# EAGLE design legatus_1_1 (EAGLE 9.6.2)
CNAME: Parrot Teensy Board; CREVISION: 1.0; DESIGNER: Nathan Villicana-Shaw

## Sheet 1 of 2
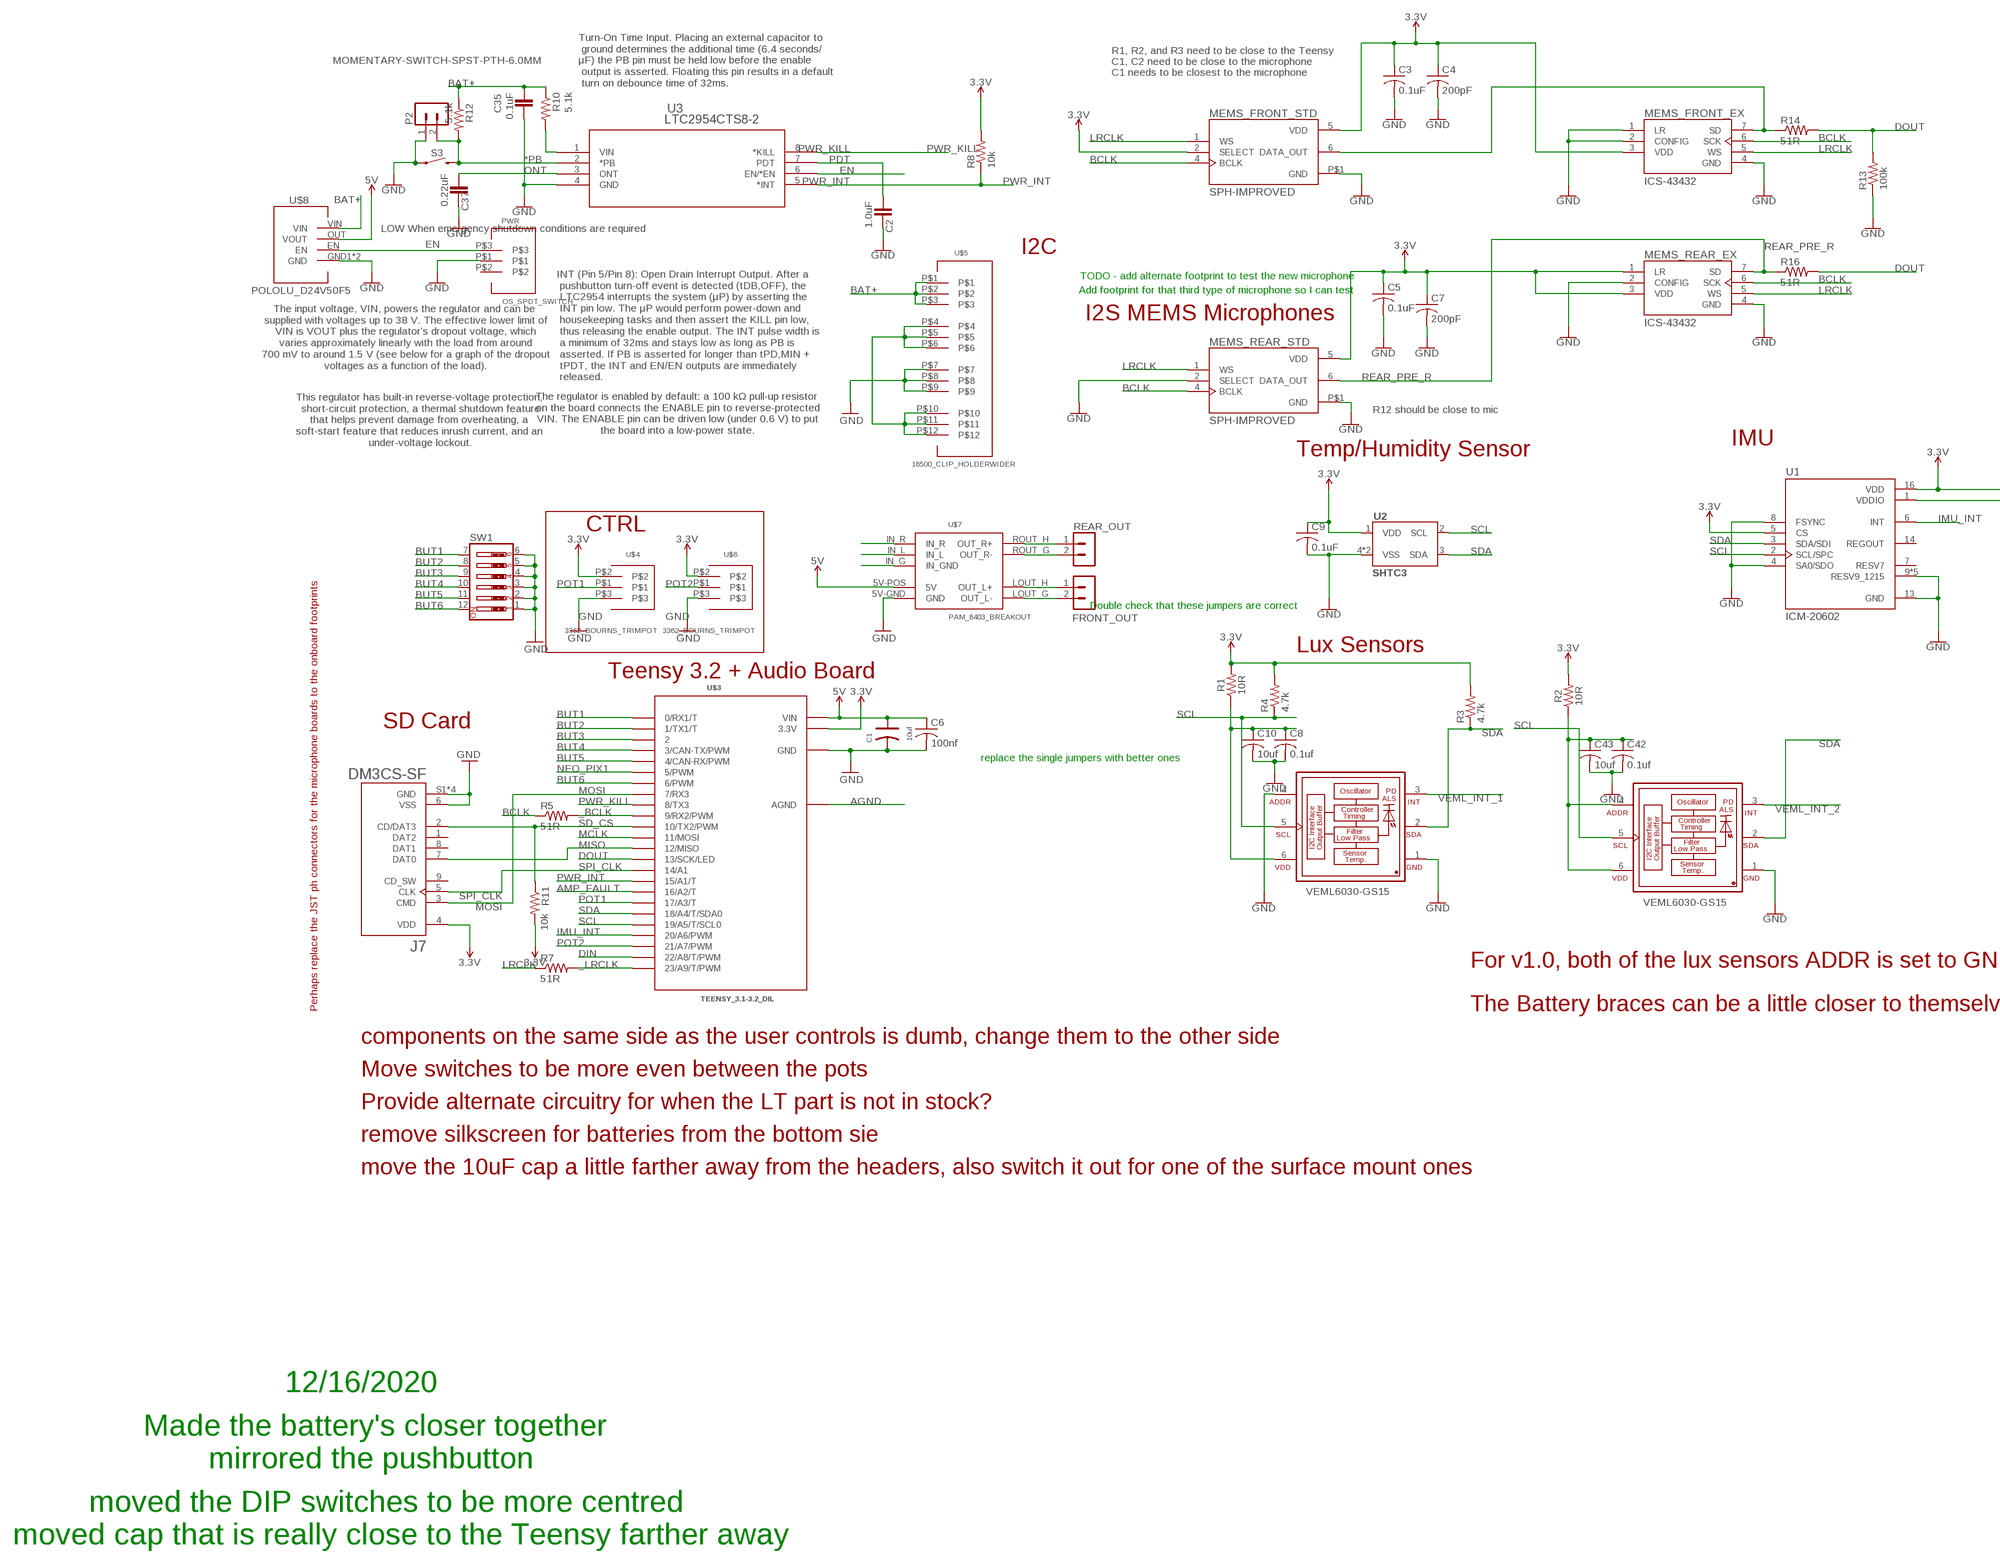
[diagram p0: schematic, sheet 1, part 1 of 2]
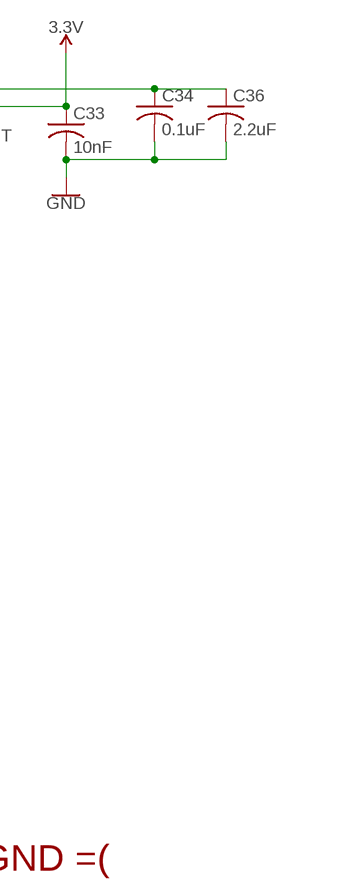
[diagram p1: schematic, sheet 1, part 2 of 2]

### Parts
C1  10uf  DIP-ALUMINUM-47UF-16V(D5-H7MM)  [PC-D5.3MM]
C2  1.0uF  C_CHIP-0805(2012-METRIC)  [CAPC2012X110]
C3  0.1uF  C-USC0805  [C0805]
C4  200pF  C-USC0805  [C0805]
C5  0.1uF  C-USC0805  [C0805]
C6  100nf  C-USC2012  [C2012]
C7  200pF  C-USC0805  [C0805]
C8  0.1uf  C-USC0805  [C0805]
C9  0.1uF  C-USC0805  [C0805]
C10  10uf  C-USC0805  [C0805]
C33  10nF  C-USC0805  [C0805]
C34  0.1uF  C-USC0805  [C0805]
C35  0.1uF  C_CHIP-0805(2012-METRIC)  [CAPC2012X110]
C36  2.2uF  C-USC0805  [C0805]
C37  0.22uF  C_CHIP-0805(2012-METRIC)  [CAPC2012X110]
C42  0.1uf  C-USC0805  [C0805]
C43  10uf  C-USC0805  [C0805]
FRONT_OUT  B2B-PH-K  [B2B-PH-K]
J7  DM3CS-SF  [HRS_DM3CS-SF]
MEMS_FRONT_EX  ICS-43432  [ICS-43432]
MEMS_FRONT_STD  SPH-IMPROVED  [MIC_SPH0645LM4H-B_LARGER_RING]
MEMS_REAR_EX  ICS-43432  [ICS-43432]
MEMS_REAR_STD  SPH-IMPROVED  [MIC_SPH0645LM4H-B_LARGER_RING]
P2  B2B-PH-K  [B2B-PH-K]
PWR  OS_SPDT_SWITCH  [OS_SPDT_SLIDE_SWITCH]
R1  10R  R-US_R0805  [R0805]
R2  10R  R-US_R0805  [R0805]
R3  4.7k  R-US_M0805  [M0805]
R4  4.7k  R-US_M0805  [M0805]
R5  51R  R-US_M0805  [M0805]
R7  51R  R-US_M0805  [M0805]
R8  10k  R-US_R0805  [R0805]
R10  5.1k  R-US_R0805  [R0805]
R11  10k  R-US_M0805  [M0805]
R12  5.1k  R-US_R0805  [R0805]
R13  100k  R-US_M0805  [M0805]
R14  51R  R-US_M0805  [M0805]
R16  51R  R-US_M0805  [M0805]
REAR_OUT  B2B-PH-K  [B2B-PH-K]
S3  MOMENTARY-SWITCH-SPST-PTH-6.0MM  [TACTILE_SWITCH_PTH_6.0MM]
SW1  SW_DIP-6  [EDG-06]
U1  ICM-20602  [PQFN50P300X300X80-16N]
U2  SHTC3  [SHTC3]
U3  LTC2954CTS8-2  [TSOT-23_TS8]
U$3  TEENSY_3.1-3.2_DIL  [TEENSY_3.0-3.2&LC_DIL]
U$4  3362_BOURNS_TRIMPOT  [3362_BOURNS_TRIMPOT]
U$5  18500_CLIP_HOLDERWIDER  [3PINBATTERY_CLIP_WIDER]
U$6  3362_BOURNS_TRIMPOT  [3362_BOURNS_TRIMPOT]
U$7  PAM_8403_BREAKOUT  [PAM8403_BREAKOUT]
U$8  POLOLU_D24V50F5  [POLOLU_D24V50F5]
VMEL_FRONT  VEML6030-GS15  [VISHAY_VEML6030_2X2X0.87]
VMEL_REAR  VEML6030-GS15  [VISHAY_VEML6030_2X2X0.87]

### Nets
3.3V [3.3V]: C3.1 C4.1 C5.1 C7.1 C9.1 C33.1 C34.1 C36.1 J7.4(VDD) MEMS_FRONT_EX.3(VDD) MEMS_FRONT_STD.2(SELECT) MEMS_FRONT_STD.5(VDD) MEMS_REAR_EX.1(LR) MEMS_REAR_EX.3(VDD) MEMS_REAR_STD.5(VDD) R1.2 R2.2 R3.2 R4.2 R8.2 R11.2 U1.1(VDDIO) U1.5(CS) U1.16(VDD) U2.1(VDD) U$3.3.3V U$4.P$2 U$6.P$2
5V: C1.+ C6.1 U$3.VIN U$7.5V-POS(5V) U$8.OUT(VOUT) ; also sheet 2
*PB: P2.2 R12.2 S3.3 U3.2(*PB)
_BCLK: R5.2 U$3.9(9/RX2/PWM)
_LRCLK: R7.2 U$3.23/A9(23/A9/T/PWM)
AGND [AGND]: U$3.AGND
AMP_FAULT: U$3.16/A2(16/A2/T)
BAT+: C35.1 R10.1 R12.1 U$5.P$1 U$5.P$2 U$5.P$3 U$8.VIN
BCLK: MEMS_FRONT_EX.6(SCK) MEMS_FRONT_STD.4(BCLK) MEMS_REAR_EX.6(SCK) MEMS_REAR_STD.4(BCLK) R5.1
BUT1: SW1.7 U$3.0(0/RX1/T)
BUT2: SW1.8 U$3.1(1/TX1/T)
BUT3: SW1.9 U$3.2
BUT4: SW1.10 U$3.3(3/CAN-TX/PWM)
BUT5: SW1.11 U$3.4(4/CAN-RX/PWM)
BUT6: SW1.12 U$3.6(6/PWM)
DIN: U$3.22/A8(22/A8/T/PWM)
DOUT: R13.2 R14.2 R16.2 U$3.13(13/SCK/LED)
EN: PWR.P$3 U3.6(EN/*EN) U$8.EN
FRONT_PRE_R: MEMS_FRONT_EX.7(SD) MEMS_FRONT_STD.6(DATA_OUT) R14.1
GND: C1.- C2.2 C3.2 C4.2 C5.2 C6.2 C7.2 C8.2 C9.2 C10.2 C33.2 C34.2 C35.2 C36.2 C37.2 C42.2 C43.2 J7.6(VSS) J7.S1(GND) J7.S2(GND) J7.S3(GND) J7.S5(GND) MEMS_FRONT_EX.1(LR) MEMS_FRONT_EX.2(CONFIG) MEMS_FRONT_EX.4(GND) MEMS_FRONT_STD.P$1(GND) MEMS_REAR_EX.2(CONFIG) MEMS_REAR_EX.4(GND) MEMS_REAR_STD.2(SELECT) MEMS_REAR_STD.P$1(GND) P2.1 PWR.P$1 R13.1 S3.1 SW1.1 SW1.2 SW1.3 SW1.4 SW1.5 SW1.6 U1.4(SA0/SDO) U1.8(FSYNC) U1.9(RESV9_1215) U1.10(RESV9_1215) U1.11(RESV9_1215) U1.12(RESV9_1215) U1.13(GND) U1.15(RESV9_1215) U2.4(VSS) U2.5(VSS) U3.4(GND) U$3.GND U$4.P$3 U$5.P$7 U$5.P$8 U$5.P$9 U$6.P$3 U$7.5V-GND(GND) U$8.GND1(GND) U$8.GND2(GND) VMEL_FRONT.1(GND) VMEL_FRONT.4(ADDR) VMEL_REAR.1(GND) ; also sheet 2
IMU_INT: U1.6(INT) U$3.20/A6(20/A6/PWM)
LRCLK: MEMS_FRONT_EX.5(WS) MEMS_FRONT_STD.1(WS) MEMS_REAR_EX.5(WS) MEMS_REAR_STD.1(WS) R7.1
MCLK: U$3.11(11/MOSI)
MISO: J7.7(DAT0) U$3.12(12/MISO)
MOSI: J7.3(CMD) U$3.7(7/RX3)
N$2: U$5.P$4 U$5.P$5 U$5.P$6 U$5.P$10 U$5.P$11 U$5.P$12
N$3: C42.1 C43.1 R2.1 VMEL_REAR.4(ADDR) VMEL_REAR.6(VDD)
N$4: C8.1 C10.1 R1.1 VMEL_FRONT.6(VDD)
N$5: R10.2 U3.1(VIN)
N$6: FRONT_OUT.2 U$7.LOUT_G(OUT_L-)
N$7: FRONT_OUT.1 U$7.LOUT_H(OUT_L+)
N$8: REAR_OUT.2 U$7.ROUT_G(OUT_R-)
N$22: REAR_OUT.1 U$7.ROUT_H(OUT_R+)
N$30: U$7.IN_G(IN_GND)
N$31: U$7.IN_L
N$32: U$7.IN_R
NEO_PIX1: U$3.5(5/PWM) ; also sheet 2
ONT: C37.1 U3.3(ONT)
PDT: C2.1 U3.7(PDT)
POT1: U$3.17/A3(17/A3/T) U$4.P$1
POT2: U$3.21/A7(21/A7/PWM) U$6.P$1
PWR_INT: R8.1 U3.5(*INT) U$3.15/A1(15/A1/T)
PWR_KILL: U3.8(*KILL) U$3.8(8/TX3)
REAR_PRE_R: MEMS_REAR_EX.7(SD) MEMS_REAR_STD.6(DATA_OUT) R16.1
SCL: R4.1 U1.2(SCL/SPC) U2.2(SCL) U$3.19/A5(19/A5/T/SCL0) VMEL_FRONT.5(SCL) VMEL_REAR.5(SCL)
SD_CS: J7.2(CD/DAT3) R11.1 U$3.10(10/TX2/PWM)
SDA: R3.1 U1.3(SDA/SDI) U2.3(SDA) U$3.18/A4(18/A4/T/SDA0) VMEL_FRONT.2(SDA) VMEL_REAR.2(SDA)
SPI_CLK: J7.5(CLK) U$3.14/A0(14/A1)
VEML_INT_1: VMEL_FRONT.3(INT)
VEML_INT_2: VMEL_REAR.3(INT)
Unconnected: J7.1(DAT2) J7.8(DAT1) J7.9(CD_SW) PWR.P$2 U1.7(RESV7) U1.14(REGOUT)

### Notes on the sheet
- R1, R2, and R3 need to be close to the Teensy
- C1, C2 need to be close to the microphone
- C1 needs to be closest to the microphone
- Turn-On Time Input. Placing an external capacitor to
   ground determines the additional time (6.4 seconds/
  μF) the PB pin must be held low before the enable
   output is asserted. Floating this pin results in a default
   turn on debounce time of 32ms.
- LOW When emergency shutdown conditions are required
- I2C
- TODO - add alternate footprint to test the new microphone
- Add footprint for that third type of microphone so I can test
- I2S MEMS Microphones
- The input voltage, VIN, powers the regulator and can be
   supplied with voltages up to 38 V. The effective lower limit of
   VIN is VOUT plus the regulator’s dropout voltage, which
   varies approximately linearly with the load from around
   700 mV to around 1.5 V (see below for a graph of the dropout
   voltages as a function of the load).
- INT (Pin 5/Pin 8): Open Drain Interrupt Output. After a
   pushbutton turn-off event is detected (tDB,OFF), the
   LTC2954 interrupts the system (μP) by asserting the
   INT pin low. The μP would perform power-down and
   housekeeping tasks and then assert the KILL pin low,
   thus releasing the enable output. The INT pulse width is
   a minimum of 32ms and stays low as long as PB is
   asserted. If PB is asserted for longer than tPD,MIN +
   tPDT, the INT and EN/EN outputs are immediately
   released.
- The regulator is enabled by default: a 100 kΩ pull-up resistor
   on the board connects the ENABLE pin to reverse-protected
   VIN. The ENABLE pin can be driven low (under 0.6 V) to put
   the board into a low-power state.
- R12 should be close to mic
- This regulator has built-in reverse-voltage protection, 
  short-circuit protection, a thermal shutdown feature
  that helps prevent damage from overheating, a 
  soft-start feature that reduces inrush current, and an 
  under-voltage lockout.
- IMU
- Temp/Humidity Sensor
- CTRL
- Double check that these jumpers are correct
- Lux Sensors
- Teensy 3.2 + Audio Board
- 10R
- 10R
- SD Card
- replace the single jumpers with better ones
- For v1.0, both of the lux sensors ADDR is set to GND =(
- Perhaps replace the JST ph connectors for the microphone boards to the onboard footprints | The Battery braces can be a little closer to themselves (the ends of the clips do not make a super strong connection with the cells
- components on the same side as the user controls is dumb, change them to the other side
- Move switches to be more even between the pots
- Provide alternate circuitry for when the LT part is not in stock?
- remove silkscreen for batteries from the bottom sie
- move the 10uF cap a little farther away from the headers, also switch it out for one of the surface mount ones
- 12/16/2020
- Made the battery's closer together
- mirrored the pushbutton
- moved the DIP switches to be more centred
- moved cap that is really close to the Teensy farther away

## Sheet 2 of 2: Neopixel LEDs
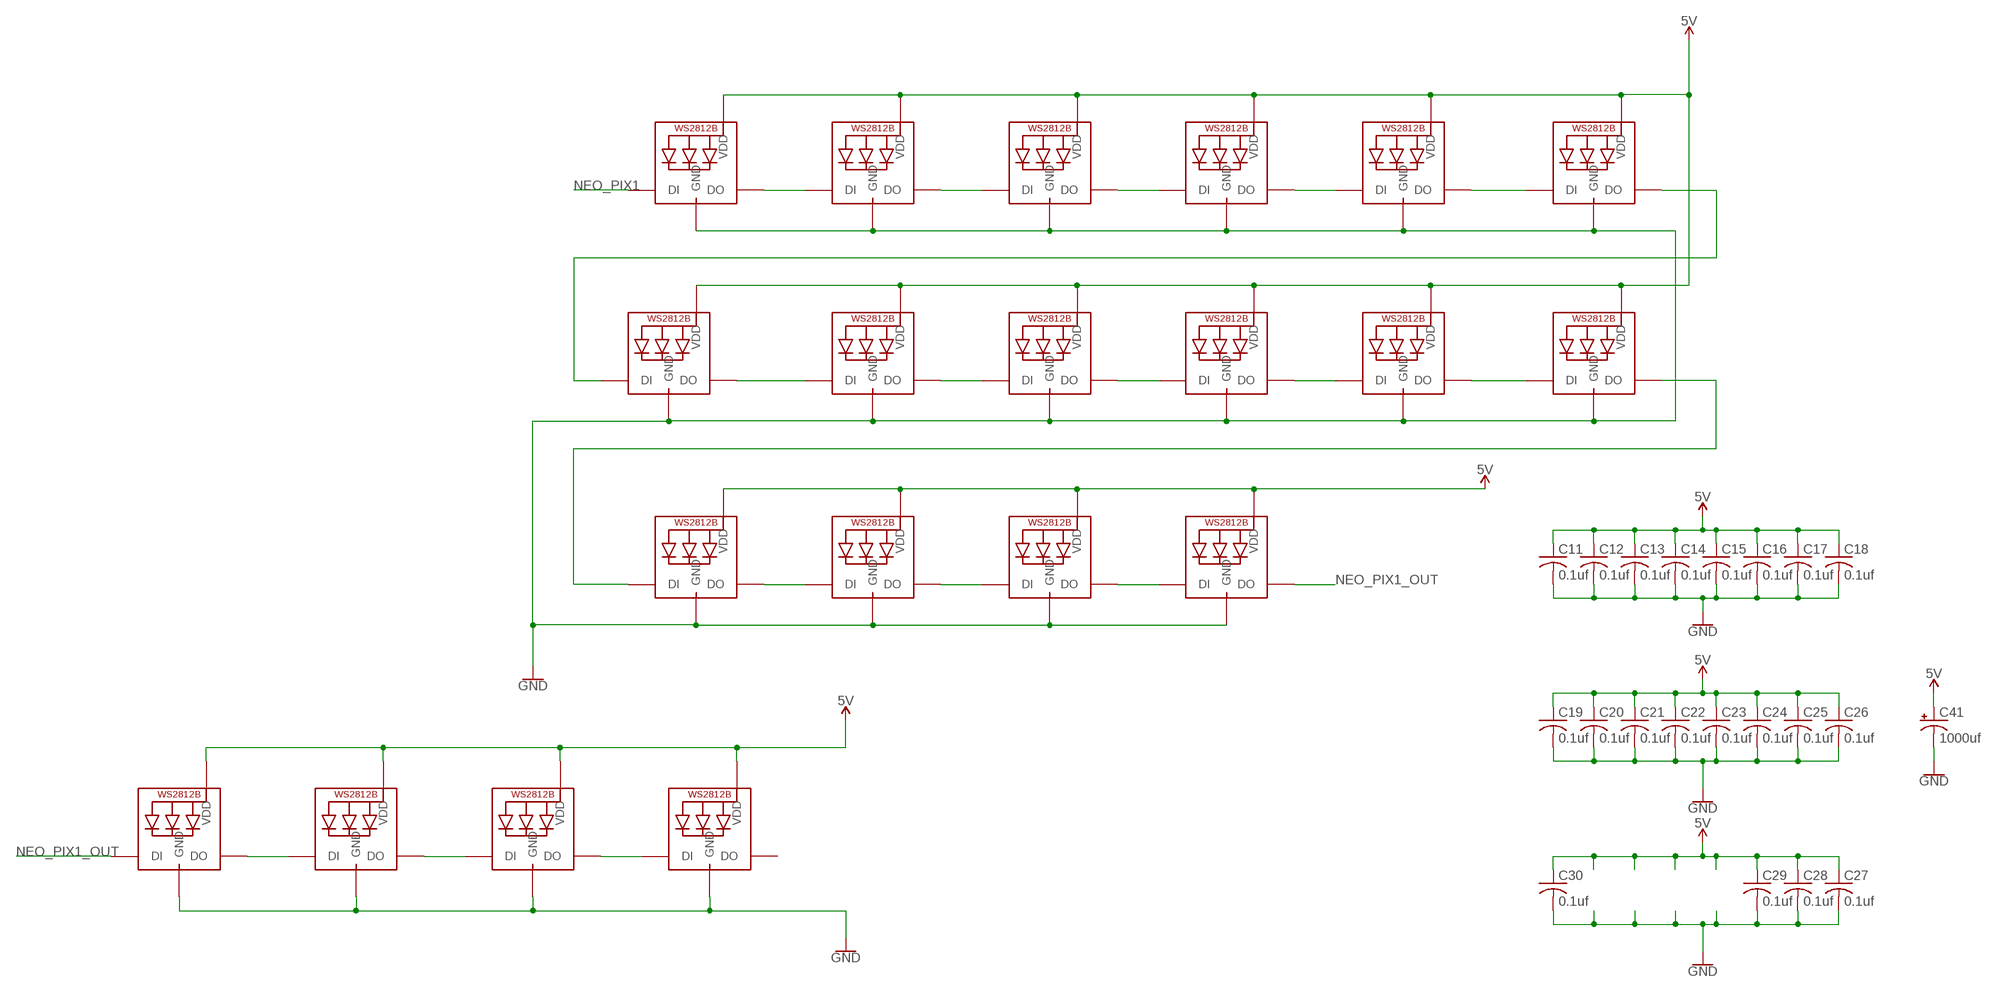
[diagram p2: schematic, sheet 2]

### Parts
C11  0.1uf  C-USC0805  [C0805]
C12  0.1uf  C-USC0805  [C0805]
C13  0.1uf  C-USC0805  [C0805]
C14  0.1uf  C-USC0805  [C0805]
C15  0.1uf  C-USC0805  [C0805]
C16  0.1uf  C-USC0805  [C0805]
C17  0.1uf  C-USC0805  [C0805]
C18  0.1uf  C-USC0805  [C0805]
C19  0.1uf  C-USC0805  [C0805]
C20  0.1uf  C-USC0805  [C0805]
C21  0.1uf  C-USC0805  [C0805]
C22  0.1uf  C-USC0805  [C0805]
C23  0.1uf  C-USC0805  [C0805]
C24  0.1uf  C-USC0805  [C0805]
C25  0.1uf  C-USC0805  [C0805]
C26  0.1uf  C-USC0805  [C0805]
C27  0.1uf  C-USC0805  [C0805]
C28  0.1uf  C-USC0805  [C0805]
C29  0.1uf  C-USC0805  [C0805]
C30  0.1uf  C-USC0805  [C0805]
C41  1000uf  CPOL-US153CLV-1010  [153CLV-1010]
LED1  WS2812B_5050N  [WS2812B-NARROW]
LED2  WS2812B_5050N  [WS2812B-NARROW]
LED3  WS2812B_5050N  [WS2812B-NARROW]
LED4  WS2812B_5050N  [WS2812B-NARROW]
LED5  WS2812B_5050N  [WS2812B-NARROW]
LED6  WS2812B_5050N  [WS2812B-NARROW]
LED7  WS2812B_5050N  [WS2812B-NARROW]
LED8  WS2812B_5050N  [WS2812B-NARROW]
LED9  WS2812B_5050N  [WS2812B-NARROW]
LED10  WS2812B_5050N  [WS2812B-NARROW]
LED11  WS2812B_5050N  [WS2812B-NARROW]
LED12  WS2812B_5050N  [WS2812B-NARROW]
LED13  WS2812B_5050N  [WS2812B-NARROW]
LED14  WS2812B_5050N  [WS2812B-NARROW]
LED15  WS2812B_5050N  [WS2812B-NARROW]
LED16  WS2812B_5050N  [WS2812B-NARROW]
LED17  WS2812B_5050N  [WS2812B-NARROW]
LED18  WS2812B_5050N  [WS2812B-NARROW]
LED19  WS2812B_5050N  [WS2812B-NARROW]
LED20  WS2812B_5050N  [WS2812B-NARROW]

### Nets
5V: C11.1 C12.1 C13.1 C14.1 C15.1 C16.1 C17.1 C18.1 C19.1 C20.1 C21.1 C22.1 C23.1 C24.1 C25.1 C26.1 C27.1 C28.1 C29.1 C30.1 C41.+ LED1.1-VDD(VDD) LED2.1-VDD(VDD) LED3.1-VDD(VDD) LED4.1-VDD(VDD) LED5.1-VDD(VDD) LED6.1-VDD(VDD) LED7.1-VDD(VDD) LED8.1-VDD(VDD) LED9.1-VDD(VDD) LED10.1-VDD(VDD) LED11.1-VDD(VDD) LED12.1-VDD(VDD) LED13.1-VDD(VDD) LED14.1-VDD(VDD) LED15.1-VDD(VDD) LED16.1-VDD(VDD) LED17.1-VDD(VDD) LED18.1-VDD(VDD) LED19.1-VDD(VDD) LED20.1-VDD(VDD) ; also sheet 1
GND: C11.2 C12.2 C13.2 C14.2 C15.2 C16.2 C17.2 C18.2 C19.2 C20.2 C21.2 C22.2 C23.2 C24.2 C25.2 C26.2 C27.2 C28.2 C29.2 C30.2 C41.- LED1.3-GND(GND) LED2.3-GND(GND) LED3.3-GND(GND) LED4.3-GND(GND) LED5.3-GND(GND) LED6.3-GND(GND) LED7.3-GND(GND) LED8.3-GND(GND) LED9.3-GND(GND) LED10.3-GND(GND) LED11.3-GND(GND) LED12.3-GND(GND) LED13.3-GND(GND) LED14.3-GND(GND) LED15.3-GND(GND) LED16.3-GND(GND) LED17.3-GND(GND) LED18.3-GND(GND) LED19.3-GND(GND) LED20.3-GND(GND) ; also sheet 1
N$9: LED1.2-DOUT(DO) LED2.4-DIN(DI)
N$10: LED2.2-DOUT(DO) LED3.4-DIN(DI)
N$11: LED3.2-DOUT(DO) LED4.4-DIN(DI)
N$12: LED4.2-DOUT(DO) LED5.4-DIN(DI)
N$13: LED5.2-DOUT(DO) LED6.4-DIN(DI)
N$14: LED7.2-DOUT(DO) LED8.4-DIN(DI)
N$15: LED8.2-DOUT(DO) LED9.4-DIN(DI)
N$16: LED9.2-DOUT(DO) LED10.4-DIN(DI)
N$17: LED10.2-DOUT(DO) LED11.4-DIN(DI)
N$18: LED11.2-DOUT(DO) LED12.4-DIN(DI)
N$19: LED13.2-DOUT(DO) LED14.4-DIN(DI)
N$20: LED14.2-DOUT(DO) LED15.4-DIN(DI)
N$21: LED15.2-DOUT(DO) LED16.4-DIN(DI)
N$23: LED12.2-DOUT(DO) LED13.4-DIN(DI)
N$24: LED6.2-DOUT(DO) LED7.4-DIN(DI)
N$26: LED18.2-DOUT(DO) LED19.4-DIN(DI)
N$29: LED19.2-DOUT(DO) LED20.4-DIN(DI)
N$43: LED17.2-DOUT(DO) LED18.4-DIN(DI)
NEO_PIX1: LED1.4-DIN(DI) ; also sheet 1
NEO_PIX1_OUT: LED16.2-DOUT(DO) LED17.4-DIN(DI)
Unconnected: LED20.2-DOUT(DO)

## Library data of the parts
C1 = Seeed-Capacitor:DIP-ALUMINUM-47UF-16V(D5-H7MM): 302030033; MPN: KS 100uF/16V; VALUE: 100uf
C2 C35 C37 = Capacitor:C: Capacitor - Generic; CATEGORY: Capacitor
C3-C5 C7-C30 C33 C34 C36 C42 C43 = rcl:C-US: CAPACITOR, American symbol; SPICEPREFIX: C
C6 = adafruit:C-US: CAPACITOR, American symbol
C41 = adafruit:CPOL-US: POLARIZED CAPACITOR, American symbol
FRONT_OUT P2 REAR_OUT = con-jst-ph:B2B-PH-K: HEADER
J7 = DM3CS-SF:DM3CS-SF: CONN MICRO SD CARD HINGED TYPE; AVAILABILITY: Unavailable; DESCRIPTION: 10 (8 + 2) Position Card Connector Secure Digital - microSD™ Surface Mount, Right Angle Gold; MF: Hirose; MP: DM3CS-SF; PACKAGE: None; PRICE: None
LED1-LED20 = nathans-custom-parts:WS2812B
MEMS_FRONT_EX MEMS_REAR_EX = Microphone:ICS-43432: MIC MEMS DIGITAL I2S OMNI -26DB Manufacturer's datasheet <http://www.invensense.com/wp-content/uploads/2015/02/ICS-43432_DS.pdf>; CREATED_BY: PCBLayout.com; DIGIKEY_PARTNO: 1428-1053-2-ND; MANUFACTURER: TDK InvenSense; MPN: ICS-43432
MEMS_FRONT_STD MEMS_REAR_STD = SPH0645LM4H-B:SPH-IMPROVED
PWR = nathans-custom-parts:OS_SPDT_SWITCH
R1 R2 = audio amplifier example:R-US_: RESISTOR, American symbol
R3-R5 R7 R13 R14 R16 = adafruit:R-US_: RESISTOR, American symbol
R8 R10 R12 = adafruit-with-additions:R-US_: RESISTOR, American symbol
R11 = rcl:R-US_: RESISTOR, American symbol; SPICEPREFIX: R
S3 = SparkFun-Switches:MOMENTARY-SWITCH-SPST: Momentary Switch (Pushbutton) - SPST Normally-open (NO) SPST momentary switches (buttons, pushbuttons). Variants PTH-12MM - 12mm square, through-hole Momentary Pushbutton Switch - 12mm Square <https://www.sparkfun.com/products/9190> (COM-09190) PTH-6.0MM, PTH-6.0MM-KIT - 6.0mm square, through-hole Mini Pushbutton Switch <https://www.sparkfun.com/products/97> (COM-00097) KIT package intended for soldering kit's - only one side of pads' copper is exposed. PTH-RIGHT-ANGLE-KIT - Right-angle, through-hole Right Angle Tactile Button <https://www.sparkfun.com/products/10791> - Used on SparkFun BigTime Watch Kit <https://www.sparkfun.com/products/11734> SMD-12MM - 12mm square, surface-mount Tactile Button - SMD (12mm) <https://www.sparkfun.com/products/12993> (COM-12993) Used on SparkFun PicoBoard <https://www.sparkfun.com/products/11888> SMD-4.5MM - 4.5mm Square Trackball Switch Used on SparkFun Blackberry Trackballer Breakout <https://www.sparkfun.com/products/13169> SMD-4.6MMX2.8MM - 4.60mm x 2.80mm, surface mount Used on SparkFun SAMD21 Mini Breakout <https://www.sparkfun.com/products/13664> SMD-5.2MM, SMD-5.2-REDUNDANT - 5.2mm square, surface-mount Mini Pushbutton Switch - SMD <https://www.sparkfun.com/products/8720> (COM-08720) Used on Arduino Pro Mini <https://www.sparkfun.com/products/11114> REDUNDANT package connects both switch circuits together SMD-6.0X3.5MM - 6.0 x 3.5mm, surface mount Momentary Reset Switch SMD <https://www.sparkfun.com/products/8229> (COM-08229) SMD-6.2MM-TALL - 6.2mm square, surface mount Tactile Button - SMD (6mm) <https://www.sparkfun.com/products/12992> Used on SparkFun Digital Sandbox <https://www.sparkfun.com/products/12651> SMD-RIGHT-ANGLE - Right-angle, surface mount Used on SparkFun Block for Intel® Edison - Arduino <https://www.sparkfun.com/products/13036>; PROD_ID: SWCH-08441; SF_SKU: COM-00097
SW1 = special:SW_DIP-6: DIP SWITCH
U1 = ICM-20602:ICM-20602: Accelerometer and Gyroscope Digital 16-Pin LGA Check prices <https://pricing.snapeda.com/parts/IAM-20680/TDK%20InvenSense/view-part?ref=eda> Check prices <https://pricing.snapeda.com/parts/ICM-20602/TDK%20InvenSense/view-part?ref=eda>; AVAILABILITY: Good; DESCRIPTION: Accelerometer, Gyroscope, Temperature, 6 Axis Sensor I²C, SPI Output; MF: TDK InvenSense; MP: ICM-20602; PACKAGE: PQFN-16 TDK-InvenSense; PRICE: None; PURCHASE-URL: https://pricing.snapeda.com/search/part/ICM-20602/?ref=eda
U2 = SHTC3:SHTC3
U3 = LTC2954CTS8-2:LTC2954CTS8-2: Check prices <https://pricing.snapeda.com/parts/LTC2954CTS8-2/Analog%20Devices%20/%20Linear%20Technology/view-part?ref=eda>; AVAILABILITY: Bad; DESCRIPTION: Power Supply Controller Push Button, On/Off Controller TSOT-23-8; MF: Analog Devices / Linear Technology; MP: LTC2954CTS8-2; PACKAGE: None; PRICE: None
U$3 = teensy_3_and_LC:TEENSY_3.1-3.2_DIL: Teensy 3.1 or 3.2 in a DIL Layout.
U$4 U$6 = nathans-custom-parts:3362_BOURNS_TRIMPOT
U$5 = nathans-custom-parts:18500_CLIP_HOLDER
U$7 = nathans-custom-parts:PAM_8403_BREAKOUT
U$8 = nathans-custom-parts:POLOLU_D24V50F5
VMEL_FRONT VMEL_REAR = VEML6030-GS15:VEML6030-GS15: VEML6030 High Accuracy Ambient Light Sensor with I2C Interface: VEML6030 is a high accuracy ambient light digital 16-bit resolution sensor in a miniature transparent 2 mm x 2 mm package. It includes a high sensitive photodiode, a low noise amplifier, a 16-bit A/D converter and supports an easy to use I2C bus communication interface and additional interrupt feature. The ambient light result is as digital value available. Device Model created 15.06.2016 by Johannes Kolb - Vishay Semiconductor GmbH; AVAILABILITY: Unavailable; DESCRIPTION: Optical Sensor Ambient 550nm I²C 6-SMD, No Lead; MF: Vishay Semiconductor; MP: VEML6030-GS15; PACKAGE: SMD-6 Vishay; PRICE: None

## Net classes
0 default: width 0.203 mm, drill 0.254 mm, clearance 0.203 mm
1 12V_IN: width 1.016 mm, drill 0.762 mm, clearance 0.305 mm
2 3.3V: width 0.305 mm, drill 0.508 mm, clearance 0.254 mm
3 5V: width 0.787 mm, drill 0.508 mm, clearance 0.381 mm
4 AGND: width 0.406 mm, drill 0.203 mm, clearance 0.203 mm

## Board
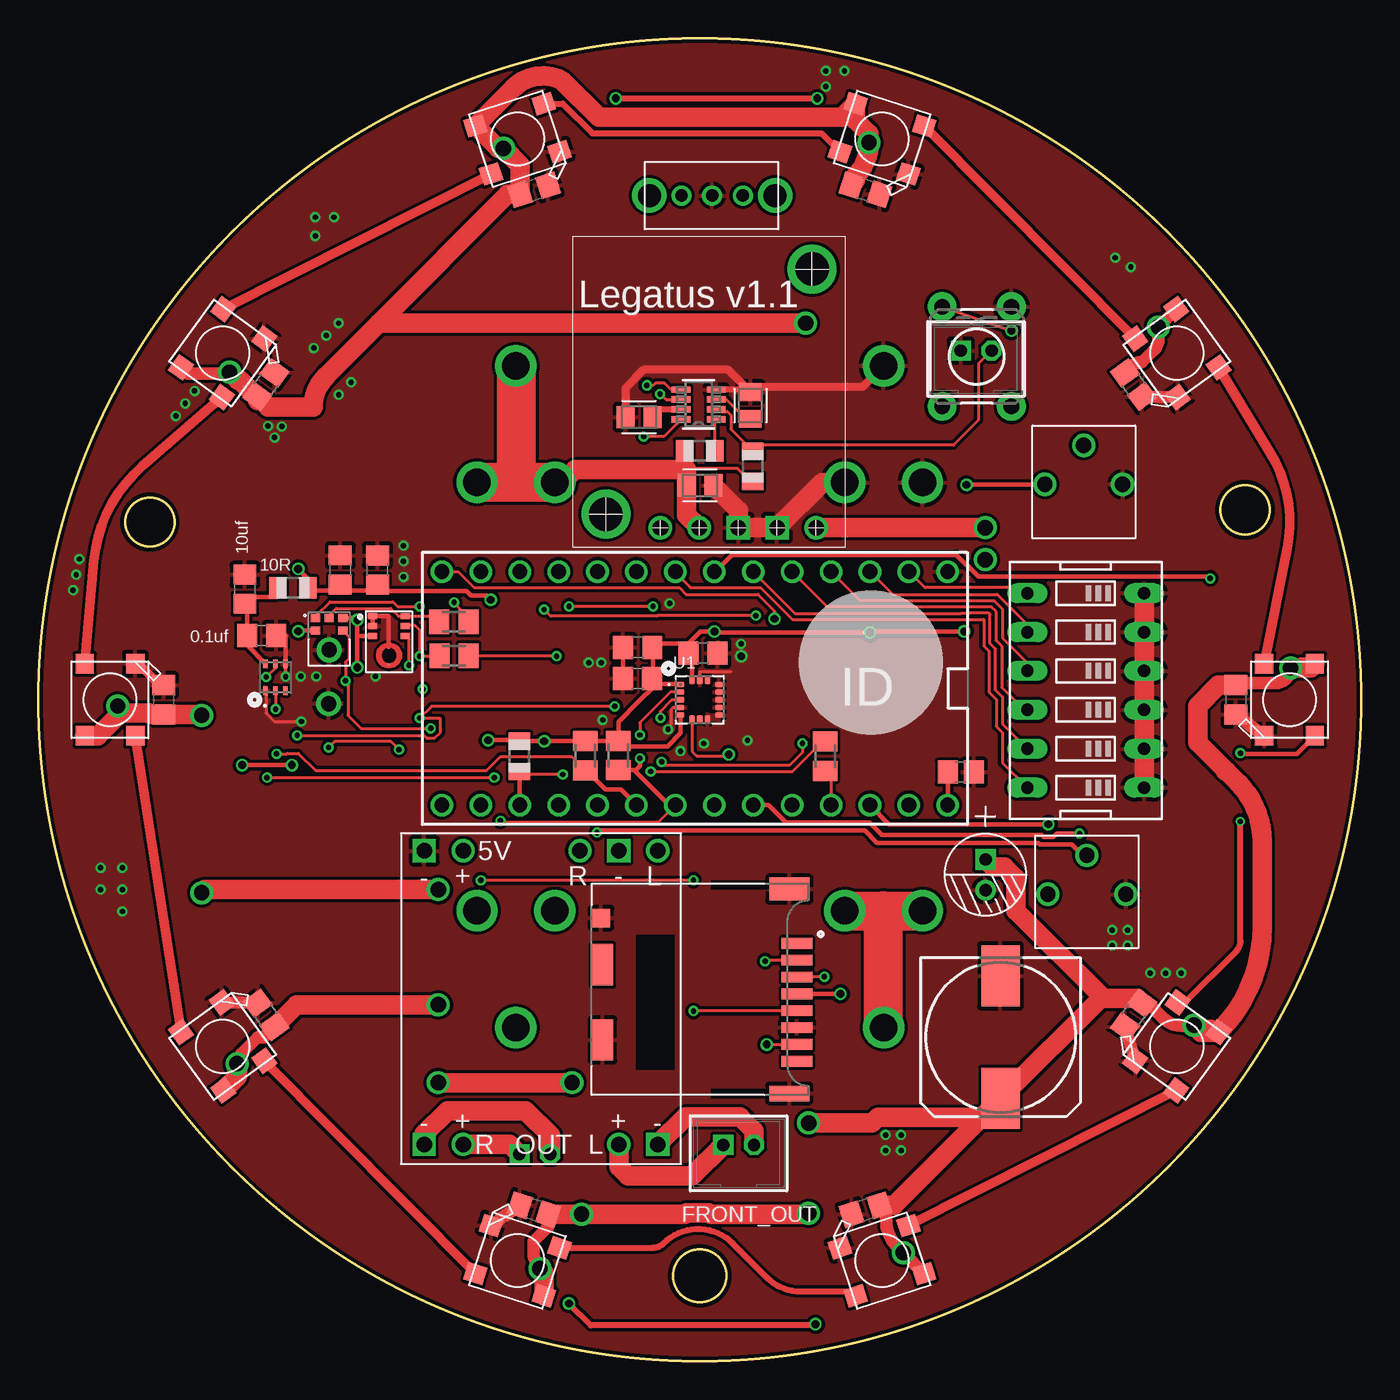
[diagram p3: board, top side]
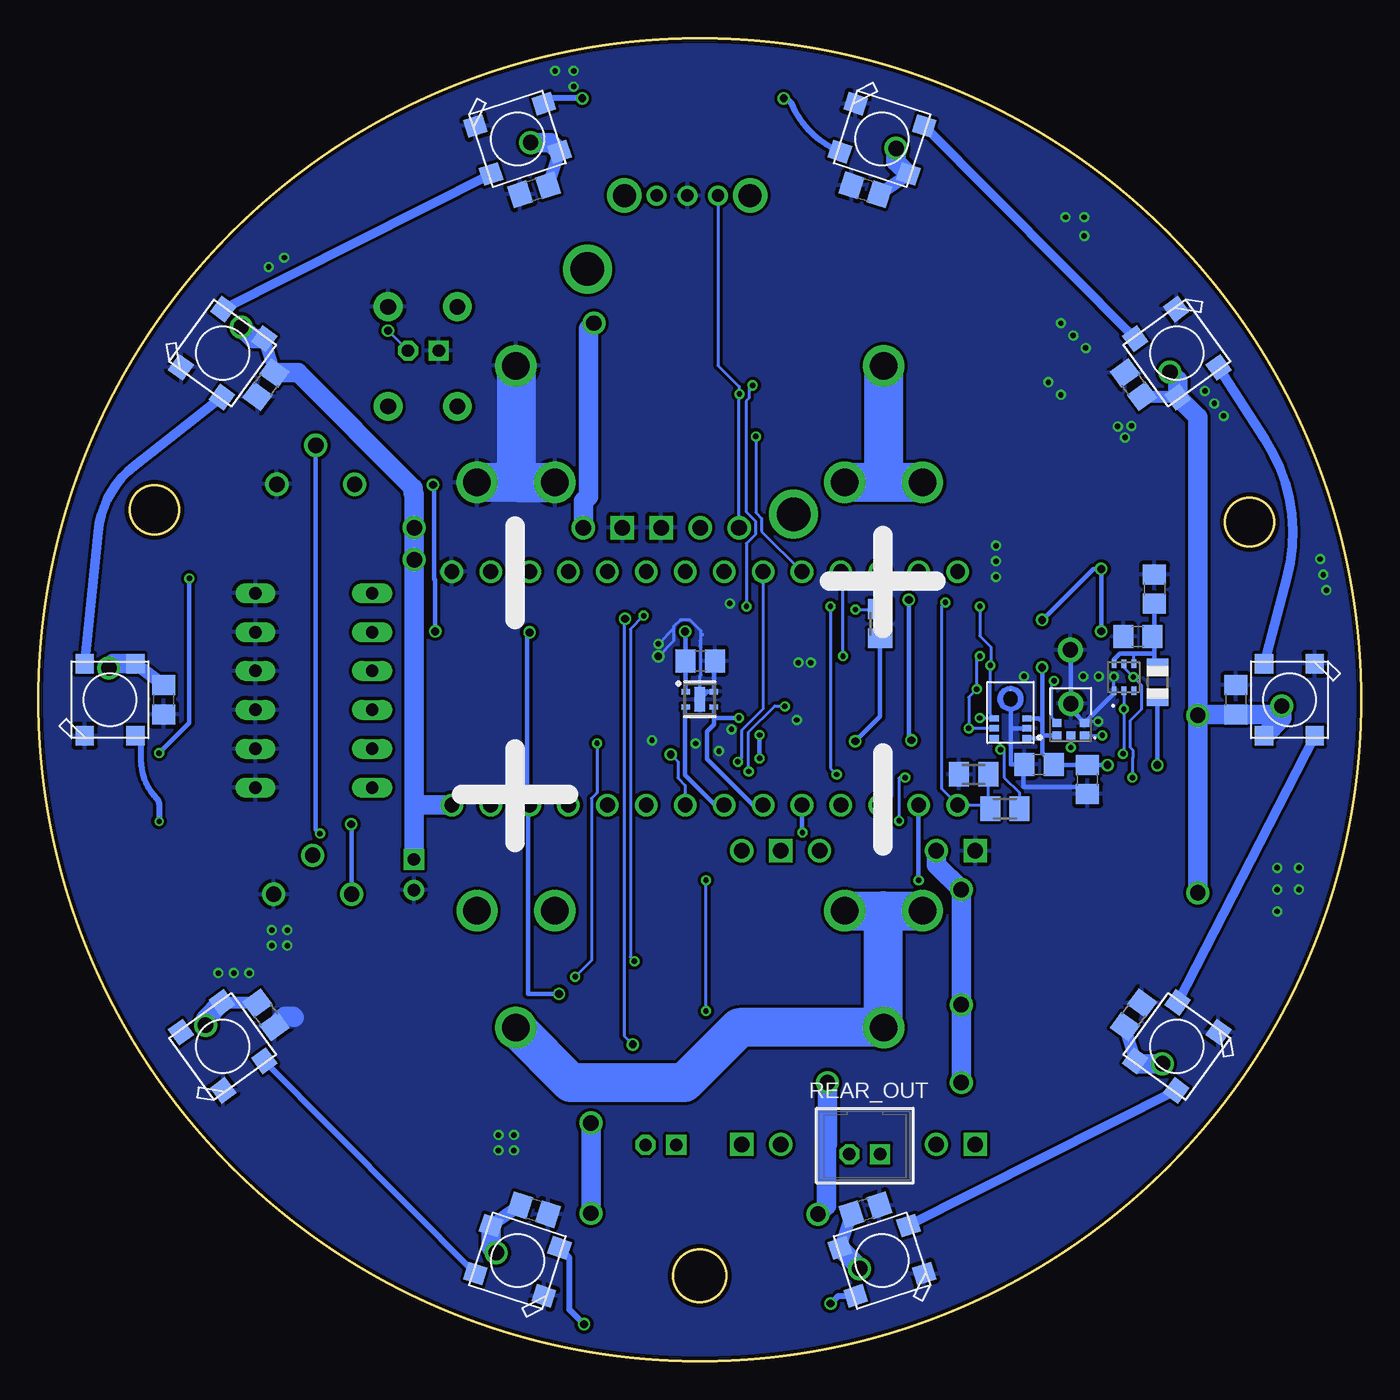
[diagram p4: board, bottom side, seen from below]

Size 86.36 x 86.36 mm. Coordinates in mm from the lower left corner, seen from the top.
Outline: circle at 43.18,43.18 radius 43.18
Outline: circle at 43.18,5.58 radius 1.73
Outline: circle at 7.28,54.78 radius 1.6
Outline: circle at 78.78,55.58 radius 1.6
Copper layers (1*16): Top 0.035mm / dielectric 1.5mm / Bottom 0.035mm
Design rules "SeeedStudio_2layer_DRU_no_angle_20140221 *": minimum track width 6mil, minimum drill 12mil, track to track 6mil, track to pad 6mil, pad to pad 6mil, via to via 6mil, smd to smd 0mil, copper to edge 10mil, drill to drill 10mil, minimum pad ring 10mil, minimum via ring 6mil, stop-mask expansion 2mil, vias tented up to drill 100mil, thermal gap 10mil

### Footprints (pad centres in the part's own frame; a part is rotated, then mirrored left to right if it is on the bottom)
PC-D5.3MM = drill 0.8 pad 1.35 square: + -1,0 | drill 0.8 pad 1.35: - 1,0
CAPC2012X110 = smd 1.165 x 1.465: 1 -0.875,0; 2 0.875,0
C0805 = smd 1.3 x 1.5: 1 -0.95,0; 2 0.95,0
C2012 = smd 1.3 x 1.5: 1 -0.85,0; 2 0.85,0
153CLV-1010 = smd 4 x 2.5: + 4,0; - -4,0
B2B-PH-K = drill 0.813 square: 1 -1,0 | drill 0.813 octagon: 2 1,0
HRS_DM3CS-SF = smd 0.7 x 2: 1 3.2,-6.35; 2 2.1,-6.35; 3 1,-6.35; 4 -0.1,-6.35; 5 -1.2,-6.35; 6 -2.3,-6.35; 7 -3.4,-6.35; 8 -4.5,-6.35 | smd 2.7 x 1.4: 9 1.8,6.35; S3 -3.1,6.35 | smd 1 x 2.6: S1 -6.6,-5.85 | smd 1.5 x 2.6: S2 6.75,-5.85 | smd 1.2 x 1.2: S5 4.85,6.45
WS2812B-NARROW = smd 1.3 x 1.2: 1-VDD 2.35,-1.65; 2-DOUT 2.35,1.65; 3-GND -2.35,1.65; 4-DIN -2.35,-1.65
ICS-43432 = smd 0.6 x 0.4: 1 -1.08,0.65; 2 -1.08,0; 3 -1.08,-0.65; 5 1.07,-0.65; 6 1.07,0; 7 1.07,0.65 | smd 0.1 x 0.1: 4 0,-2.5
MIC_SPH0645LM4H-B_LARGER_RING = smd 0.6 x 0.522: 1 -0.9,2.074; 2 -0.9,1.252; 4 0.9,1.252; 5 0.9,2.074; 6 0,2.074 | drill 1 pad 1.626: P$1 0,0
OS_SPDT_SLIDE_SWITCH = drill 0.8: P$1 0,0; P$2 2,0; P$3 -2,0 | drill 1.5: P$4 4.1,0; P$5 -4.1,0
R0805 = smd 1.1 x 1.4: 1 -1,0; 2 1,0
M0805 = smd 1.3 x 1.6: 1 -0.95,0; 2 0.95,0
TACTILE_SWITCH_PTH_6.0MM = drill 1.016 pad 1.88: 1 -3.251,2.261; 2 3.251,2.261; 3 -3.251,-2.261; 4 3.251,-2.261
EDG-06 = drill 0.813 long: 1 -6.35,-3.81; 2 -3.81,-3.81; 3 -1.27,-3.81; 4 1.27,-3.81; 5 3.81,-3.81; 6 6.35,-3.81; 7 6.35,3.81; 8 3.81,3.81; 9 1.27,3.81; 10 -1.27,3.81; 11 -3.81,3.81; 12 -6.35,3.81
PQFN50P300X300X80-16N = smd 0.49 x 0.35: 1 -1.26,1; 2 -1.26,0.5; 3 -1.26,0; 4 -1.26,-0.5; 5 -1.26,-1; 9 1.26,-1; 10 1.26,-0.5; 11 1.26,0; 12 1.26,0.5; 13 1.26,1 | smd 0.35 x 0.49: 6 -0.5,-1.26; 7 0,-1.26; 8 0.5,-1.26; 14 0.5,1.26; 15 0,1.26; 16 -0.5,1.26
SHTC3 = smd 0.55 x 0.35: 1 -0.925,0.5; 2 -0.925,-0.5; 3 0.925,-0.5; 4 0.925,0.5 | smd 0.7 x 1.6: 5 0,0
TSOT-23_TS8 = smd 1.219 x 0.406: 1 -1.143,0.975; 2 -1.143,0.325; 3 -1.143,-0.325; 4 -1.143,-0.975; 5 1.143,-0.975; 6 1.143,-0.325; 7 1.143,0.325; 8 1.143,0.975
TEENSY_3.0-3.2&LC_DIL = drill 0.965: 0 -7.62,13.97; 1 -7.62,11.43; 2 -7.62,8.89; 3 -7.62,6.35; 3.3V 7.62,11.43; 4 -7.62,3.81; 5 -7.62,1.27; 6 -7.62,-1.27; 7 -7.62,-3.81; 8 -7.62,-6.35; 9 -7.62,-8.89; 10 -7.62,-11.43; 11 -7.62,-13.97; 12 -7.62,-16.51; 13 7.62,-16.51; 14/A0 7.62,-13.97; 15/A1 7.62,-11.43; 16/A2 7.62,-8.89; 17/A3 7.62,-6.35; 18/A4 7.62,-3.81; 19/A5 7.62,-1.27; 20/A6 7.62,1.27; 21/A7 7.62,3.81; 22/A8 7.62,6.35; 23/A9 7.62,8.89; AGND 7.62,13.97; GND -7.62,16.51; VIN 7.62,16.51
3362_BOURNS_TRIMPOT = drill 1: P$1 0,2.54; P$2 -2.54,0; P$3 2.54,0
3PINBATTERY_CLIP_WIDER = drill 1.8: P$1 -21.6,12; P$2 -13.98,14.54; P$3 -13.98,9.46; P$4 13.98,14.54; P$5 13.98,9.46; P$6 21.6,12; P$7 -21.6,-12; P$8 -13.98,-9.46; P$9 -13.98,-14.54; P$10 13.98,-9.46; P$11 13.98,-14.54; P$12 21.6,-12
PAM8403_BREAKOUT = drill 1 square: 5V-GND 7.62,-9.652; IN_G -5.08,-9.652; LOUT_G -7.62,9.525; ROUT_G 7.62,9.525 | drill 1: 5V-POS 5.08,-9.652; IN_L -7.62,-9.652; IN_R -2.54,-9.652; LOUT_H -5.08,9.525; ROUT_H 5.08,9.525
POLOLU_D24V50F5 = drill 1.02: EN -3.175,-8.89; OUT 6.985,-8.89; VIN -0.635,-8.89 | drill 1.02 square: GND1 1.905,-8.89; GND2 4.445,-8.89 | drill 2.18: P$6 -6.731,-8.001; P$7 6.731,8.001
VISHAY_VEML6030_2X2X0.87 = smd 0.55 x 0.3: 1 -0.875,0.65; 2 -0.875,0; 3 -0.875,-0.65; 4 0.875,-0.65; 5 0.875,0; 6 0.875,0.65

### Placement (x,y rotation side)
C1  61.84,31.76 270 top
C2  39.21,61.63 180 top
C3  22.14,51.66 90 top
C4  19.72,51.66 90 top
C5  17.88,37.97 270 bottom
C6  60.22,38.46 0 top
C7  21.03,38.96 180 bottom
C8  14.57,47.37 0 top
C9  43.15,45.71 0 bottom
C10  13.49,50.4 90 top
C11  78.18,43.18 270 top
C12  71.5,63.75 306 top
C13  54,76.47 342 top
C14  32.36,76.47 18 top
C15  14.86,63.75 54 top
C16  8.18,43.18 90 top
C17  14.86,22.61 126 top
C18  32.36,9.89 162 top
C19  54,9.89 198 top
C20  71.5,22.61 234 top
C21  78.18,43.18 270 bottom
C22  71.5,63.75 234 bottom
C23  54,76.47 198 bottom
C24  32.36,76.47 162 bottom
C25  14.86,63.75 126 bottom
C26  8.18,43.18 90 bottom
C27  14.86,22.61 54 bottom
C28  32.36,9.89 18 bottom
C29  54,9.89 342 bottom
C30  71.5,22.61 306 bottom
C33  39.13,44.56 180 top
C34  43.38,46.22 0 top
C35  43.2,57.17 0 top
C36  39.13,46.6 180 top
C37  46.48,62.39 90 top
C41  62.81,21.16 270 top
C42  14.58,47.3 180 bottom
C43  13.49,50.4 90 bottom
FRONT_OUT  45.72,14.12 0 top
J7  43.18,24.08 90 top
LED1  81.68,43.18 90 top
LED2  74.33,65.81 126 top
LED3  55.08,79.8 162 top
LED4  31.28,79.8 198 top
LED5  12.03,65.81 234 top
LED6  4.68,43.18 270 top
LED7  12.03,20.55 306 top
LED8  31.28,6.56 342 top
LED9  55.08,6.56 18 top
LED10  74.33,20.55 54 top
LED11  81.68,43.18 90 bottom
LED12  74.33,65.81 54 bottom
LED13  55.08,79.8 18 bottom
LED14  31.28,79.8 342 bottom
LED15  12.03,65.81 306 bottom
LED16  4.68,43.18 270 bottom
LED17  12.03,20.55 234 bottom
LED18  31.28,6.56 198 bottom
LED19  55.08,6.56 162 bottom
LED20  74.33,20.55 126 bottom
MEMS_FRONT_EX  22.9,47.99 0 top
MEMS_FRONT_STD  18.98,46.44 0 top
MEMS_REAR_EX  22.9,41.32 180 bottom
MEMS_REAR_STD  18.96,42.92 180 bottom
P2  61.22,65.97 0 top
PWR  43.99,76.1 0 top
R1  16.62,50.48 0 top
R2  13.3,44.33 270 bottom
R3  35.72,39.53 90 top
R4  37.87,39.55 90 top
R5  27.14,46.05 0 top
R7  51.37,39.49 270 top
R8  31.41,39.49 90 top
R10  43.18,59.44 0 top
R11  31.41,48.15 270 bottom
R12  46.63,58.42 90 top
R13  25.3,38.3 0 bottom
R14  27.13,48.26 0 top
R16  23.27,36.07 180 bottom
REAR_OUT  32.41,13.51 180 bottom
S3  61.26,65.58 270 top
SW1  68.38,43.79 90 top
U1  43.18,43.18 0 top
U2  43.18,43.21 0 bottom
U3  43.1,62.46 180 top
U$3  42.86,43.93 270 top
U$4  68.45,30.49 0 top
U$5  43.18,43.38 270 bottom
U$6  68.25,57.25 0 top
U$7  32.82,23.67 180 top
U$8  43.79,63.3 0 top
VMEL_FRONT  15.49,44.65 90 top
VMEL_REAR  15.49,44.65 90 bottom

### Tracks (layer width: path | path; a pad name or v marks a point on that pad's centre or on a via)
3.3V  (via drill 0.51)
  Top 0.305: U1.5 41.92,41 41.06,40.14 38.23,40.14 R4.2 | R4.2 35.74,40.5 R3.2 v33.02,40.48 31.42,40.48 R8.2 31.36,40.54 v29.36,40.54 | v20.83,45.29 20.83,47.34 | 20.83,47.34 v20.83,48.39 20.83,48.51 MEMS_FRONT_STD.5 | MEMS_FRONT_EX.3 20.83,47.34 | 42.43,46.85 40.08,46.85 C36.1 40.13,46.55 40.13,44.2 | v44.13,47.63 43.21,47.63 42.43,46.85 | 42.43,46.85 C34.1 42.67,45.99 42.67,44.45 U1.16 | 40.13,43.99 40.13,44.2 | 40.13,43.99 39.22,43.08 39.21,43.08 37.87,41.74 R4.2 | 40.13,43.99 40.23,44.1 | v60.45,47.64 54.36,47.64 v54.29,47.57 44.2,47.57 v44.13,47.63 | v60.59,57.21 65.67,57.21 U$6.P$2 | v65.94,35.05 55.54,35.05 U$3.3.3V | J7.4 v52.36,23.98 v52.37,23.98 | v13.31,38.91 v16.56,38.91 | MEMS_FRONT_STD.2 17.01,47.69 v16.97,47.65 | v16.97,51.71 17.62,51.06 R1.2 17.62,50.3 19.31,50.3 C4.1 20.12,50.3 21.73,50.3 C3.1 22.55,50.29 27.96,50.29 28.25,50 29.29,50 29.53,49.76 v29.53,49.71 | v44.13,47.63 | U1.1 41.9,44.2 40.13,44.2
  Top 0.406: C33.1 40.13,44.51 40.13,44.2
  Bottom 0.305: U2.1 C9.1 44.1,47.6 v44.13,47.63 | MEMS_REAR_EX.3 21.03,41.96 20.83,41.76 | 20.83,41.76 20.83,40.9 | 20.83,40.9 20.83,40.74 | 20.83,40.74 20.83,39.71 C7.1 20.08,38.92 C5.1 v16.56,38.91 | MEMS_REAR_EX.1 20.9,40.67 20.83,40.74 | MEMS_REAR_STD.5 20.78,40.85 20.83,40.9 | 20.83,41.76 v20.83,45.29 | v54.29,47.57 54.45,47.41 54.45,36.47 U$3.3.3V 54.4,36.2 54.4,23.98 v52.37,23.98 | v60.45,47.64 60.45,51.01 60.51,51.07 60.51,57.13 v60.59,57.21 | U$4.P$2 65.91,35.02 v65.94,35.05 | R2.2 13.3,38.92 v13.31,38.91 | v16.97,47.65 v16.97,51.71 17.5,51.71 v20.83,48.39 | R11.2 31.41,42.09 v33.02,40.48 | v29.53,49.71 29.53,40.71 v29.36,40.54
5V  (via drill 1)
  Top 0.305: C6.1 U$3.VIN
  Top 0.813: LED7.1-VDD 13.24,18.84 13.24,20.06 14.32,21.14 14.72,21.14 C27.1 | LED8.1-VDD 33.01,6.32 arc-90 32.33,7 32.33,7.84 33.27,8.78 C28.1 | C29.1 55.34,9.74 55.34,9.26 arc45 56.1,7.43 56.11,7.43 v56.46,7.08 LED9.1-VDD | C20.1 72.47,23.38 73.46,22.39 arc45 74.64,21.9 76.62,21.9 LED10.1-VDD | LED1.1-VDD 82.44,45.53 81.48,44.57 arc-45 80.76,44.27 78.32,44.27 C21.1 | LED2.1-VDD v73.12,67.52 73.12,66.71 arc-45 72.83,66.02 72.04,65.22 arc45 71.35,64.94 C22.1 | C25.1 13.89,62.98 12.41,64.46 9.74,64.46 LED5.1-VDD
  Top 1.27: C25.1 15.01,62.28 17.94,62.28 arc-45 18.78,64.31 22.24,67.77 | 22.24,67.77 30.65,76.17 C24.1 31.46,78.08 v30.37,79.18 30,79.18 LED4.1-VDD 31,83.1 arc-72 34.19,83.6 36.6,81.2 52.46,81.2 LED3.1-VDD 53.35,81.01 54.22,80.14 v54.22,79.55 54.22,79.46 arc-45 53.35,77.35 53.35,77.11 53.09,76.85 C23.1 | C25.1 14.31,62.7 | v81.75,45.26 83.05,45.26 LED1.1-VDD | v75.45,21.93 75.9,21.48 LED10.1-VDD arc45 79.9,28.39 79.9,33.94 arc45 78.32,37.76 77.55,38.53 | v32.74,6.05 33.01,5.78 LED8.1-VDD | v12.97,19.42 12.97,18.57 LED7.1-VDD | v12.49,64.56 13.01,64.04 13.18,64.04 14.23,62.98 C25.1 | 77.55,38.53 77.5,38.53 | U$8.OUT v61.81,54.41 | C41.+ 61.59,15.93 | 61.59,15.93 55.84,10.19 C29.1 | C1.+ 62.33,32.27 63.06,32.27 63.83,31.5 63.83,29.41 69.45,23.79 | 77.55,38.53 75.69,40.39 75.69,42.77 77.05,44.13 C21.1 | v26.11,23.27 16.85,23.27 C27.1 | v10.67,42.16 10.6,42.23 C26.1 7.37,42.23 7.28,42.32 5.64,42.32 v5.18,42.77 5.32,42.64 5.32,42.25 3.9,40.83 LED6.1-VDD | v10.67,30.58 10.87,30.79 v26.11,30.79 | v50.29,9.65 50.24,9.6 43.93,9.6 43.82,9.63 43.75,9.69 42.33,9.69 42.23,9.6 v35.46,9.6 C28.1 | v50.29,15.54 54.44,15.54 54.83,15.93 61.59,15.93 | v26.11,18.19 v34.85,18.19 | v50.09,67.77 22.24,67.77 | 69.45,23.79 C41.+ | C41.+ | 69.45,23.79 69.55,23.69 70.93,23.69 70.94,23.67 71.76,23.67 C20.1
  Bottom 0.813: LED18.1-VDD C28.1 | C29.1 LED19.1-VDD | C20.1 LED20.1-VDD | C21.1 LED11.1-VDD | C22.1 LED12.1-VDD | C23.1 LED13.1-VDD | C24.1 LED14.1-VDD | C25.1 LED15.1-VDD | C27.1 LED17.1-VDD
  Bottom 1.27: LED12.1-VDD 72.34,66.74 v73.12,67.52 | LED11.1-VDD 81.48,45.53 v81.75,45.26 | LED20.1-VDD 75.45,22.35 v75.45,21.93 | LED19.1-VDD 56.8,7.42 v56.46,7.08 | LED18.1-VDD 32.74,6.12 v32.74,6.05 | LED17.1-VDD 14.55,19.42 v12.97,19.42 | LED16.1-VDD 5.18,41.98 v5.18,42.77 5.73,42.23 C26.1 10.6,42.23 v10.67,42.16 | v12.49,64.56 11.99,64.06 LED15.1-VDD 10.67,61.62 v10.67,42.16 | LED14.1-VDD 30.37,78.31 v30.37,79.18 | LED13.1-VDD 52.93,79.55 v54.22,79.55 | 61.81,36.47 v61.81,52.32 v61.81,54.41 61.81,56.6 61.89,56.67 61.89,57.01 69.4,64.52 C22.1 | 61.81,36.47 61.81,32.78 C1.+ | U$3.VIN 61.64,36.31 61.81,36.47 | U$7.5V-POS 27.74,32.41 v26.11,30.79 v26.11,23.27 v26.11,18.19 | v10.67,42.16 v10.67,30.58 | v50.29,9.65 v50.29,15.54 | v34.85,18.19 34.85,14.19 34.91,14.13 34.91,10.15 v35.46,9.6 | U$8.OUT 50.77,56.13 50.45,56.46 50.45,67.4 v50.09,67.77
*PB  (via drill 0.51)
  Top 0.203: P2.2 61.37,65.12 61.37,61.44 59.74,59.8 47.02,59.8 R12.2 46.63,59.44 45.21,60.86 45.21,61.76 44.98,61.99 44.39,61.99 U3.2 | S3.3 v63.52,67.28
  Bottom 0.203: v63.52,67.28 P2.2
_BCLK  (via drill 0.35)
  Top 0.203: R5.2 33.81,46.05 v33.83,46.02
  Bottom 0.203: v33.83,46.02 33.83,51.41 U$3.9
_LRCLK
  Top 0.203: R7.2 51.75,38.16 U$3.23/A9
BAT+
  Top 0.203: 42.32,55.78 C35.1 42.32,58.22 42.32,58.28 | 42.32,58.28 42.32,59.29 R10.1 | R12.1 46.52,57.42 45.66,58.28 42.32,58.28
  Top 1.27: U$5.P$3 34.2,57.36 35.05,58.22 42.32,58.22 42.32,55.78 42.32,55.24 U$8.VIN
  Top 2.54: U$5.P$3 31.19,57.36 | 31.19,57.36 U$5.P$2 | U$5.P$1 31.18,57.37 31.19,57.36
  Bottom 2.54: U$5.P$2 30.99,57.36 | 30.99,57.36 U$5.P$3 | U$5.P$1 31.18,57.55 30.99,57.36
BCLK  (via drill 0.35)
  Top 0.203: R5.1 26.16,46.02 v24.89,46.02 24.89,47.73 24.61,48.01 23.98,48.01 MEMS_FRONT_EX.6 | MEMS_FRONT_STD.4 20.29,47.29 20.29,45.87 20.05,45.64 v20.05,44.41 20.22,44.24 20.22,42.16 21.07,41.32 v25.62,41.32
  Bottom 0.203: MEMS_REAR_EX.6 v25.62,41.32 25.62,43.35 v25.09,43.87 25.09,45.82 v24.89,46.02 | MEMS_REAR_STD.4 20.24,42.05 20.24,44.22 v20.05,44.41
BUT1
  Top 0.203: U$3.0 57.88,50.49 64.22,50.49 SW1.7
BUT2
  Top 0.203: U$3.1 55.78,50.05 62.61,50.05 64.57,48.09 SW1.8
BUT3
  Top 0.203: U$3.2 53.65,49.65 62.4,49.65 62.94,49.1 62.94,47.2 64.57,45.57 SW1.9
BUT4
  Top 0.203: U$3.3 51.52,49.23 60.57,49.23 60.58,49.24 62.23,49.24 62.53,48.93 62.53,47.03 62.89,46.68 62.89,43.99 64.36,42.52 SW1.10
BUT5
  Top 0.203: U$3.4 49.39,48.82 60.23,48.82 60.74,48.82 60.75,48.83 62.06,48.83 62.13,48.76 62.13,46.86 62.48,46.51 62.48,43.82 62.94,43.37 62.94,41.6 SW1.11
BUT6
  Top 0.203: U$3.6 41.59,51.47 42.56,50.49 47.14,50.49 49.24,48.4 61.7,48.4 61.72,48.43 61.72,46.7 62.08,46.34 62.08,43.66 62.53,43.2 62.53,41.44 62.94,41.03 62.94,39.06 SW1.12
DOUT  (via drill 0.35)
  Top 0.203: R14.2 28.08,48.57 27.15,49.5 v27.15,49.53
  Bottom 0.203: U$3.13 26.31,36.31 | 26.31,36.31 24.45,36.31 R16.2 24.35,36.2 R13.2 | v27.15,49.53 27.4,49.28 27.4,37.39 26.31,36.31
EN  (via drill 0.35)
  Top 0.203: v40.58,63.14 40.63,63.14 40.99,62.78 U3.6
  Bottom 0.203: U$8.EN 40.62,63.11 | 40.62,63.11 40.62,63.63 41.99,65 PWR.P$3 | 40.62,63.11 v40.58,63.14
FRONT_PRE_R
  Top 0.203: MEMS_FRONT_STD.6 18.9,48.59 19.46,49.15 23,49.15 23.51,48.64 MEMS_FRONT_EX.7 25.79,48.64 R14.1
GND  (via drill 0.35, 0.51)
  Top 0.203: VMEL_FRONT.1 14.86,43.76 14.86,42.31 15.41,41.76 v17.17,41.76 | v16.14,44.69 VMEL_FRONT.4 | U1.4 41.46,42.68 41.32,42.54 41.32,41.58 | C34.2 | U1.15 43.18,45.01 45.21,45.01
  Top 0.305: VMEL_FRONT.4 16.14,47.38 C8.2 | MEMS_FRONT_EX.2 MEMS_FRONT_EX.1 22.86,48.64 22.86,46.63 | C33.2 C36.2
  Top 0.406: U3.4 46.31,63.43 C37.2
  Top 0.508: C2.2 38.34,63.53 39.52,64.72 45.02,64.72 C37.2 46.81,63.6 53.8,63.6 U$5.P$7
  Top 0.61: C26.2 7.92,44.13 6.52,45.53 LED6.3-GND
  Top 0.813: C22.2 LED2.3-GND | C21.2 LED1.3-GND | LED10.3-GND C30.2 | C28.2 LED8.3-GND | C27.2 LED7.3-GND
  Top 1.27: SW1.6 SW1.5 SW1.4 SW1.3 SW1.2 SW1.1 | U$5.P$8 51.19,57.36 U$8.GND2 U$8.GND1 45.7,55.54 C35.2
  Bottom 0.203: v17.17,41.76 17.97,41.76 MEMS_REAR_STD.2 | VMEL_REAR.1 v16.14,44.69 | v16.14,44.69 | 43.09,46.61 43.18,46.7 43.18,47.04 | 43.09,46.61 43.09,47.67 43.82,48.4 44.45,48.4 44.9,47.95 44.9,47.82 | 42.98,47.45 43.09,47.33 | 44.9,47.82 v45.89,46.83 | 43.09,46.61 43.09,44.81 43.18,44.73 U2.5 | v45.89,46.01 44.9,47 44.9,47.82
  Bottom 0.305: U2.4 42.25,45.65 C9.2 | U2.4 42.68,43.71 U2.5 43.18,43.71 U2.4 | VMEL_REAR.1 16.14,43.58 MEMS_REAR_STD.2 18.75,42.37 18.8,42.37 18.96,42.53 MEMS_REAR_STD.P$1 18.96,46.41 MEMS_FRONT_STD.P$1 | MEMS_REAR_EX.2 22.86,41.32 | 22.86,41.32 22.86,42.57 | 22.86,41.32 22.86,38.96 C7.2 22.05,38.96 22.05,37.49 18.39,37.49 18.39,37.02 C5.2
  Bottom 1.27: C30.2 70.27,22.5 69.72,22.5 69.66,22.44
  Bottom 2.54: U$5.P$7 55.18,57.41 55.13,57.36 U$5.P$8 U$5.P$9
  other vias: 51.41,84.23 52.63,84.23 51.41,83.21 18.08,74.68 19.3,74.68 18.08,73.46 4.06,30.79 5.49,30.79 5.49,29.36 5.49,32.21 4.06,32.21 19.61,63.09 20.42,63.91 17.98,66.14 18.8,66.95 19.61,67.77 72.58,25.34 73.6,25.34 74.61,25.34 56.32,14.77 56.32,13.75 55.31,13.75 55.31,14.77 2.68,52.36 2.48,51.34 2.27,50.33 8.98,61.71 9.59,62.52 10.2,63.33 15.89,61.02 14.99,61.06 15.42,60.3 70.31,72.04 71.32,71.43 71.12,27.13 70.1,27.13 70.1,28.15 71.12,28.15 23.84,53.24 23.84,52.22 23.84,51.21 17.13,44.7 18.15,44.7 22.01,44.7 41.92,39.83 36.84,41.86 41.11,41.25 43.45,40.32 46.29,40.53 36.74,45.61 35.93,45.61 41.21,49.47
  pour Top: 43.8,86.21 42.61,86.21 arc90 -0.05,43.54 -0.05,42.86 arc90 42.76,0.05 43.45,0.05 arc90 86.46,43.06 86.46,43.55 arc90
  pour Top: 86.36,43.73 86.36,43.23 arc-90 43.13,0 42.72,0 arc-90 0,42.72 0,43.31 arc-90 43.02,86.33 43.76,86.33 arc-90
  pour Bottom: 86.36,43.63 86.36,42.92 arc-90 43.44,0 42.96,0 arc-90 0,42.96 arc-90 43.48,86.44 43.56,86.44 arc-90
IMU_INT  (via drill 0.51)
  Top 0.203: U1.6 42.68,39.82 42.98,39.52 44.99,39.52 v45.07,39.61
  Bottom 0.203: v45.07,39.61 44.61,39.15 44.61,38.08 44.13,37.59 U$3.20/A6
LRCLK  (via drill 0.35)
  Top 0.203: MEMS_FRONT_EX.5 24.21,47.1 v24.21,45.42 | MEMS_FRONT_STD.1 18.18,48.6 18.18,48.7 19.04,49.56 23.16,49.56 23.45,49.28 v24.89,49.28 | v37.63,42.75 25.66,42.75 v24.91,41.99 24.95,41.95 26.25,41.95 26.25,41.05 25.88,40.69 25.35,40.69 25.18,40.86 v16.9,40.86 | v39.98,38.5 40.01,38.47 49.21,38.47 51.18,40.44 R7.1
  Bottom 0.203: v24.89,49.28 24.89,47.35 24.16,46.62 24.16,45.47 v24.21,45.42 24.23,45.39 24.23,42.23 MEMS_REAR_EX.5 23.99,41.99 v24.91,41.99 | MEMS_REAR_STD.1 16.92,40.85 v16.9,40.86 | v39.98,38.5 40.02,38.53 40.02,41.04 38.28,42.78 37.66,42.78 v37.63,42.75
MISO  (via drill 0.51)
  Top 0.203: U$3.12 27.42,51.55 28.46,50.51 41.85,50.51 42.3,50.06 46.98,50.06 48.06,48.98 v48.06,48.46 | v47.55,20.68 J7.7
  Bottom 0.203: v47.55,20.68 48.12,21.25 48.12,48.4 v48.06,48.46
MOSI  (via drill 0.35)
  Top 0.203: v49.89,40.34 49.89,39.75 49.03,38.9 40.93,38.9 v40.69,39.13 | v51.31,25.09 51.29,25.08 J7.3
  Bottom 0.203: U$3.7 39.06,51.54 39.06,42.58 40.45,41.18 40.45,39.37 v40.69,39.13 | v49.89,40.34 49.89,37.1 50.25,36.74 50.25,26.15 v51.31,25.09
N$2
  Top 2.54: U$5.P$10 55.17,29.4 | 55.17,29.4 U$5.P$11 | U$5.P$12 55.18,29.39 55.17,29.4
  Bottom 2.54: U$5.P$5 31.19,29.4 | 31.19,29.4 U$5.P$4 | 31.19,29.4 31.18,29.39 U$5.P$6 40.6,21.78 44.2,18.19 51.58,18.19 U$5.P$12
N$3
  Bottom 0.203: VMEL_REAR.4 14.84,46.1 14.93,46.2
  Bottom 0.305: VMEL_REAR.6 16.14,45.81 15.75,46.2 14.93,46.2 13.54,46.2 13.51,46.23 | 13.51,46.23 13.51,47.18 C42.1 13.49,47.44 C43.1 | 13.51,46.23 13.51,45.54 R2.1
N$4
  Top 0.305: R1.1 15.54,50.48 15.54,49.89 13.49,49.89 C10.1 13.62,49.45 C8.1 13.62,46.74 VMEL_FRONT.6
N$5
  Top 0.203: R10.2 44.18,61.42 U3.1
N$6
  Top 1.27: U$7.LOUT_G 42.24,15.95 45.82,15.95 46.72,15.05 FRONT_OUT.2
N$7
  Top 1.27: FRONT_OUT.1 42.69,12.09 38.51,12.09 37.9,12.7 U$7.LOUT_H
N$8
  Top 1.27: U$7.ROUT_G 25.2,14.83 26.72,16.36 31.8,16.36 33.43,14.73 33.43,13.53 REAR_OUT.2
N$9
  Top 0.61: LED2.4-DIN 80.44,59.28 arc-43 81.53,53.07 LED1.2-DOUT
N$10
  Top 0.61: LED3.4-DIN LED2.2-DOUT
N$11
  Top 0.406: LED4.4-DIN 34.23,82.09 36.17,80.16 51.13,80.16 LED3.2-DOUT
N$12
  Top 0.61: LED4.2-DOUT LED5.4-DIN
N$13
  Top 0.61: LED6.4-DIN 3.63,52.25 arc-44 6.79,58.43 LED5.2-DOUT
N$14
  Top 0.61: LED7.2-DOUT LED8.4-DIN
N$15
  Top 0.406: LED8.2-DOUT 40.11,7.41 arc45 40.82,7.7 arc-90 45.33,7.7 47.58,5.46 arc45 49.77,4.55 53.07,4.55 LED9.4-DIN
N$16
  Top 0.61: LED10.4-DIN LED9.2-DOUT
N$17  (via drill 0.3)
  Top 0.406: LED10.2-DOUT 74.85,23.42 78.2,26.77 arc45 78.48,27.44 78.48,35.22 78.47,35.22 v78.47,35.24
  Bottom 0.406: v78.47,35.24 78.47,36.36 arc-45 78.63,36.73 arc45 79.66,39.23 79.66,40.46 LED11.4-DIN
N$18
  Bottom 0.61: LED11.2-DOUT 82.46,54.13 arc46 80.09,58.45 LED12.4-DIN
N$19  (via drill 0.51)
  Top 0.406: v37.69,82.44 v50.85,82.44
  Bottom 0.406: LED14.4-DIN arc45 37.17,82.09 37.52,82.44 v37.69,82.44 | v50.85,82.44 53,82.44 LED13.2-DOUT
N$20
  Bottom 0.61: LED14.2-DOUT LED15.4-DIN
N$21
  Bottom 0.61: LED15.2-DOUT 6.29,60.2 arc48 4.85,51.12 LED16.4-DIN
N$22
  Top 1.27: U$7.ROUT_H 30.77,14.15 REAR_OUT.1
N$23
  Bottom 0.61: LED12.2-DOUT LED13.4-DIN
N$24
  Top 0.61: LED6.2-DOUT LED7.4-DIN
N$26  (via drill 0.51)
  Top 0.406: v50.73,2.41 50.7,2.38 50.7,2.34 36.07,2.34 v34.65,3.76
  Bottom 0.406: LED19.4-DIN 51.7,6.77 51.7,3.38 v50.73,2.41 | v34.65,3.76 34.14,4.27 LED18.2-DOUT
N$29
  Bottom 0.406: LED19.2-DOUT LED20.4-DIN
N$43
  Bottom 0.61: LED17.2-DOUT LED18.4-DIN
NEO_PIX1  (via drill 0.35)
  Top 0.305: U$3.5 44.21,51.55 45.3,52.64 59.93,52.64 61.35,51.22 76.39,51.22 v76.5,51.1 | v78.47,39.7 78.52,39.65 82.15,39.65 LED1.4-DIN
  Bottom 0.305: v76.5,51.1 76.5,41.67 v78.47,39.7
NEO_PIX1_OUT
  Bottom 0.61: LED16.2-DOUT LED17.4-DIN
ONT
  Top 0.203: U3.3 44.91,62.78 46.18,61.51 C37.1
PDT
  Top 0.406: U3.7 40.59,62.13 C2.1
POT1  (via drill 0.35)
  Top 0.305: U$4.P$1 68.17,33.03 67.46,33.73 65.39,33.73 65.29,33.83 54.76,33.83 53.95,34.65 36.61,34.65 v36.47,34.51
  Bottom 0.305: U$3.17/A3 36.51,34.54 v36.47,34.51
POT2  (via drill 0.35)
  Top 0.305: v67.97,34.44 66.48,34.44 66.28,34.24 65.6,34.24 65.5,34.34 55.07,34.34 54.24,35.16 48.81,35.16 47.66,36.31 U$3.21/A7
  Bottom 0.305: U$6.P$1 68.25,34.72 v67.97,34.44
PWR_INT  (via drill 0.35)
  Top 0.203: U3.5 41.29,63.43 40.88,63.85 40.29,63.85 40.14,63.7 v39.73,63.7 | v40.13,49.28 v34.65,49.28 | v34.24,38.3 31.6,38.3 R8.1
  Top 0.305: U$3.15/A1 31.41,36.32 R8.1
  Bottom 0.203: v39.73,63.7 39.95,63.48 39.95,62.88 40.16,62.67 40.16,55.46 39.55,54.85 39.55,53.96 40.13,53.38 v40.13,49.28 | v34.65,49.28 34.65,38.71 v34.24,38.3
PWR_KILL  (via drill 0.35)
  Top 0.203: U3.8 40.85,60.37 v39.52,60.37
  Bottom 0.203: v39.52,60.37 39.52,55.4 39.14,55.02 39.14,54.17 U$3.8
REAR_PRE_R  (via drill 0.35)
  Top 0.203: v18.96,40.06 19.34,40.44 23.03,40.44 v23.54,39.93
  Bottom 0.203: MEMS_REAR_EX.7 23.32,40.02 | R16.1 22.32,37.11 23.32,38.11 23.32,40.02 | MEMS_REAR_STD.6 v18.96,40.06 | v23.54,39.93 23.41,39.93 23.32,40.02
SCL  (via drill 0.35)
  Top 0.203: v14.93,38.1 v29.77,38.1 | v30.16,35.27 30.25,35.19 40.47,35.19 U$3.19/A5 | VMEL_REAR.5 15.48,45.52 15.48,45.26 14.88,44.66 v14.87,44.66 | v39.27,40.88 v39.28,40.88 39.28,41.69 41.27,43.68 U1.2
  Top 0.305: U$3.19/A5 41.18,36.31 38.95,38.54 | 38.95,38.54 38.89,38.6 R4.1 | v39.28,39.36 39.28,38.87 38.95,38.54
  Bottom 0.203: VMEL_REAR.5 15.49,45.28 v14.87,44.66 14.35,44.15 14.35,42.54 15.09,41.81 15.09,40.08 14.91,39.91 14.91,39.38 14.93,39.36 v14.93,38.1 | v29.77,38.1 30.14,38.1 30.18,38.06 30.18,35.29 v30.16,35.27
  Bottom 0.305: U2.2 44.16,42.66 44.16,38.26 42.2,36.31 U$3.19/A5 | v39.27,40.88 v39.27,39.36 v39.28,39.36
SD_CS  (via drill 0.35)
  Top 0.203: J7.2 47.52,26.18 v47.45,26.11 | v46.84,48.67 40.42,48.67 40.39,48.64 33.45,48.64 v33.02,49.07
  Bottom 0.203: U$3.10 31.43,49.28 | 31.43,49.28 31.43,49.11 | v46.84,48.67 47.71,47.79 47.71,26.38 v47.45,26.11 | v33.02,49.07 31.63,49.07 31.43,49.28
  Bottom 0.305: 31.43,49.11 R11.1
SDA  (via drill 0.35)
  Top 0.203: v15.54,39.65 16.22,39.65 16.25,39.67 16.98,39.67 18.11,38.55 29.25,38.55 30.18,39.47 34.82,39.47 R3.1 | VMEL_REAR.2 v15.49,42.58 v15.49,42.57 | v40.62,42 40.62,42.43 41.35,43.16 41.9,43.16 U1.3
  Top 0.305: U$3.18/A4 38.03,37.32 37.02,37.32 35.76,38.58 R3.1
  Bottom 0.203: VMEL_REAR.2 v15.49,42.57 15.49,39.7 v15.54,39.65
  Bottom 0.305: U$3.18/A4 39.71,36.31 42.71,39.3 42.71,41.09 42.25,41.55 42.25,42 | U2.3 42.25,42 | v40.62,42 42.25,42
SPI_CLK  (via drill 0.35)
  Top 0.203: J7.5 42.79,22.88 v42.77,22.86 | v42.77,31.39 v28.89,31.39
  Bottom 0.203: v42.77,22.86 v42.77,31.39
  Bottom 0.305: v28.89,31.39 U$3.14/A0

### Text on the board
tPlace: Legatus v1.1
tNames: ID
bValues: + | -